# EAGLE design V4-AddOnSduino-V002 (EAGLE 9.3.0)
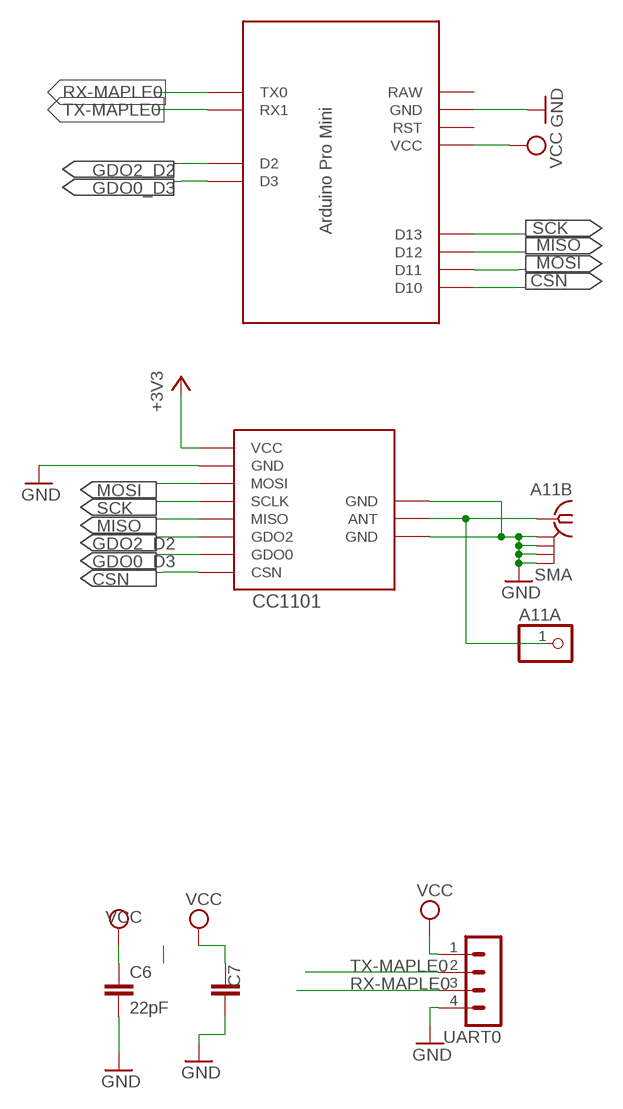
[diagram p0: schematic, sheet 1]

## Parts
A11A  PINHD-1X1  [1X01]
A11B  SMA  [SMA]
C6  22pF  C-EUC0805  [C0805]
C7  C-EUC1812  [C1812]
CC1101  CC1101_MODULE1SMD  [CC1101_MODULE1_SMD]
U$2  MARTIN-PROMINI-CC1101  [MARTIN-PRO-CC1101]
UART0  MA04-1  [MA04-1]

## Nets
+3V3: CC1101.VCC
ANT1: A11A.1 A11B.1 CC1101.ANT
CSN: CC1101.CSN U$2.D10
GDO0_D3: CC1101.GDO0 U$2.D3
GDO2_D2: CC1101.GDO2 U$2.D2
GND [PWR]: A11B.GND@1 A11B.GND@2 A11B.GND@3 A11B.GND@4 C6.2 C7.1 CC1101.GND@0(GND) CC1101.GND@1(GND) CC1101.GND@2(GND) U$2.GND UART0.4
MISO: CC1101.MISO U$2.D12
MOSI: CC1101.MOSI U$2.D11
RX-MAPLE0: U$2.TX0 UART0.3
SCK: CC1101.SCLK U$2.D13
TX-MAPLE0: U$2.RX1 UART0.2
VCC [PWR]: C6.1 C7.2 U$2.VCC UART0.1
Unconnected: U$2.RAW U$2.RST

## Library data of the parts
A11A = pinhead:PINHD-1X1: PIN HEADER
A11B = wireless:SMA: SMA 50 Ohm end launch jack receptacle - round contact
C6 C7 = rcl:C-EU: CAPACITOR, European symbol; SPICEPREFIX: C
CC1101 = CC1101:CC1101_MODULE1: CC1101 wireless module for 433/868 MHz (sold from Aliexpress). DIL version for mounting with pin header (and SMD soldering) and SMD only variant available.
U$2 = Arduino-clone:MARTIN-PROMINI-CC1101
UART0 = con-lstb:MA04-1: PIN HEADER; OC_FARNELL: unknown; OC_NEWARK: unknown

## Net classes
0 default: width 0.305 mm
1 PWR: width 0.61 mm

## Board
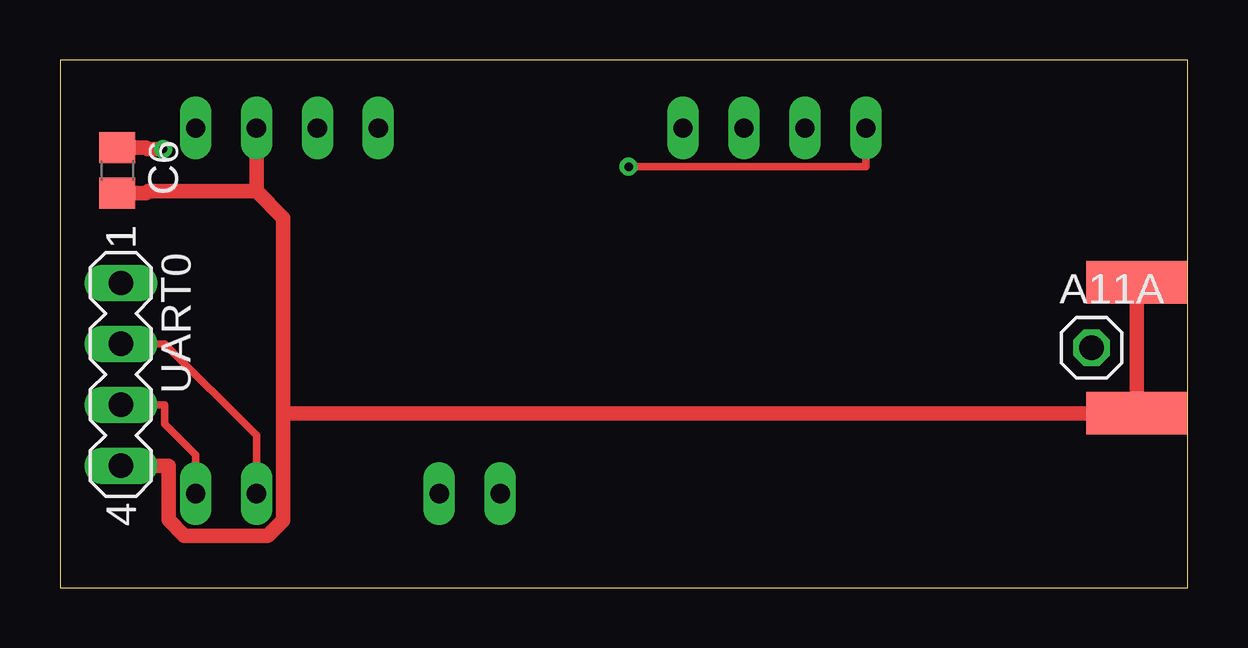
[diagram p1: board, top side]
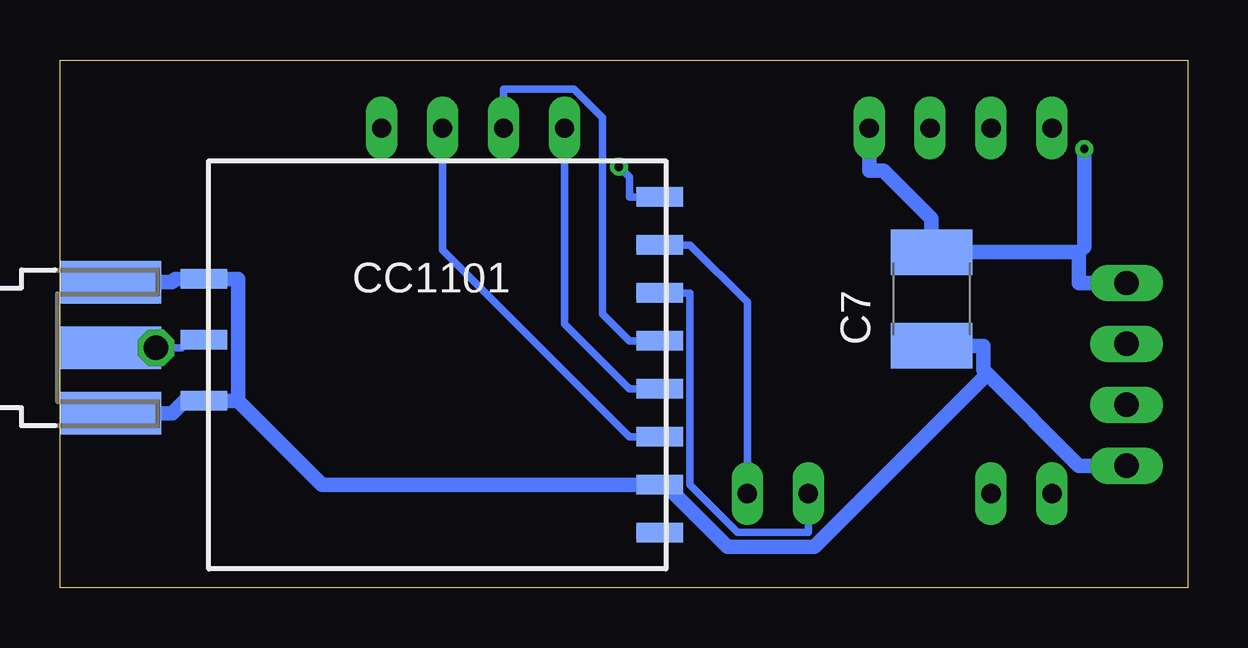
[diagram p2: board, bottom side, seen from below]

Size 47 x 22 mm. Coordinates in mm from the lower left corner, seen from the top.
Outline: 0,0 47,0 47,22 0,22 0,0
Copper layers (1*16): Top 0.035mm / dielectric 1.5mm / Bottom 0.035mm
Design rules "default": minimum track width 6mil, minimum drill 0.35mm, track to track 6mil, track to pad 6mil, pad to pad 6mil, via to via 6mil, smd to smd 6mil, copper to edge 40mil, drill to drill 6mil, minimum pad ring 10mil, minimum via ring 8mil, stop-mask expansion 4mil, vias tented up to drill 0mil, thermal gap 10mil

### Footprints (pad centres in the part's own frame; a part is rotated, then mirrored left to right if it is on the bottom)
1X01 = drill 1.016 octagon: 1 0,0
SMA = smd 4.191 x 1.778: 1 2.115,0; GND@1 2.115,2.733; GND@2 2.115,-2.733 | smd 4.191 x 1.778 bottom: GND@3 2.115,2.733; GND@4 2.115,-2.733
C0805 = smd 1.3 x 1.5: 1 -0.95,0; 2 0.95,0
C1812 = smd 1.9 x 3.4: 1 -1.95,0; 2 1.95,0
CC1101_MODULE1_SMD = smd 1.93 x 0.813: ANT 19,5.96; CSN 0,0; GDO0 0,2; GDO2 0,4; GND@0 0,12; GND@1 19,8.5; GND@2 19,3.42; MISO 0,6; MOSI 0,10; SCLK 0,8; VCC 0,14
MARTIN-PRO-CC1101 = drill 0.8 long: D2 -5.08,-3.81; D3 -5.08,-6.35; D10 10.16,-21.59; D11 10.16,-19.05; D12 10.16,-16.51; D13 10.16,-13.97; GND 10.16,3.81; RAW 10.16,6.35; RST 10.16,1.27; RX1 -5.08,3.81; TX0 -5.08,6.35; VCC 10.16,-1.27
MA04-1 = drill 1.016 long: 1 -3.81,0; 2 -1.27,0; 3 1.27,0; 4 3.81,0

### Placement (x,y rotation side)
A11A  43,10 0 top
A11B  47,10 0 bottom
C6  2.4,17.39 270 top
C7  10.67,12.03 90 bottom
CC1101  22,16.29 180 bottom
U$2  12,9 90 top
UART0  2.54,8.89 270 top

### Tracks (layer width: path | path; a pad name or v marks a point on that pad's centre or on a via)
ANT1
  Bottom 0.305: A11B.1 A11A.1 41.93,10 41.6,10.33 CC1101.ANT
CSN  (via drill 0.35 pad 0.76)
  Top 0.305: v23.7,17.55 33.59,17.55 U$2.D10
  Bottom 0.305: v23.7,17.55 23.27,17.11 23.27,16.29 CC1101.CSN
GDO0_D3
  Bottom 0.305: CC1101.GDO0 20.73,14.29 18.35,11.91 U$2.D3
GDO2_D2
  Bottom 0.305: CC1101.GDO2 20.73,12.29 20.73,4.29 18.75,2.31 15.81,2.31 U$2.D2
GND
  Top 0.61: 9.3,7.27 9.3,15.42 8.19,16.53 | 9.3,7.27 9.3,2.8 8.65,2.15 5.18,2.15 4.52,2.82 4.52,5.08 UART0.4 | 9.3,7.27 A11B.GND@4 A11B.GND@3 | 8.19,16.53 3.69,16.53 3.6,16.45 C6.2 | 8.19,16.53 8.19,17.39 U$2.GND
  Bottom 0.61: 8.35,8.9 8.51,9.07 8.51,10.08 C7.1 | 8.35,8.9 4.52,5.08 UART0.4 | 8.35,8.9 15.55,1.69 19.17,1.69 21.77,4.29 CC1101.GND@0 23.23,4.29 36.08,4.29 39.58,7.79 | 39.58,7.79 39.58,12.87 CC1101.GND@2 42.19,12.87 42.33,12.73 A11B.GND@3 | 39.58,7.79 CC1101.GND@1 41.81,7.79 42.33,7.27 A11B.GND@4
MISO
  Bottom 0.305: CC1101.MISO 23.27,10.29 24.39,11.41 24.39,19.59 25.57,20.77 28.51,20.77 U$2.D12
MOSI
  Bottom 0.305: CC1101.MOSI 23.27,6.29 31.05,14.07 U$2.D11
RX-MAPLE0
  Top 0.305: U$2.TX0 5.65,5.53 4.37,6.81 4.37,7.62 UART0.3
SCK
  Bottom 0.305: CC1101.SCLK 23.27,8.29 25.97,10.99 U$2.D13
TX-MAPLE0
  Top 0.305: UART0.2 4.37,10.16 8.19,6.34 U$2.RX1
VCC  (via drill 0.35 pad 0.76)
  Top 0.61: C6.1 3.6,18.34 3.66,18.29 v4.3,18.29
  Bottom 0.61: 4.52,13.98 8.51,13.98 C7.2 10.67,15.39 12.68,17.39 13.27,17.39 U$2.VCC | v4.3,18.29 4.3,14.2 4.52,13.98 | 4.52,13.98 4.52,12.7 UART0.1